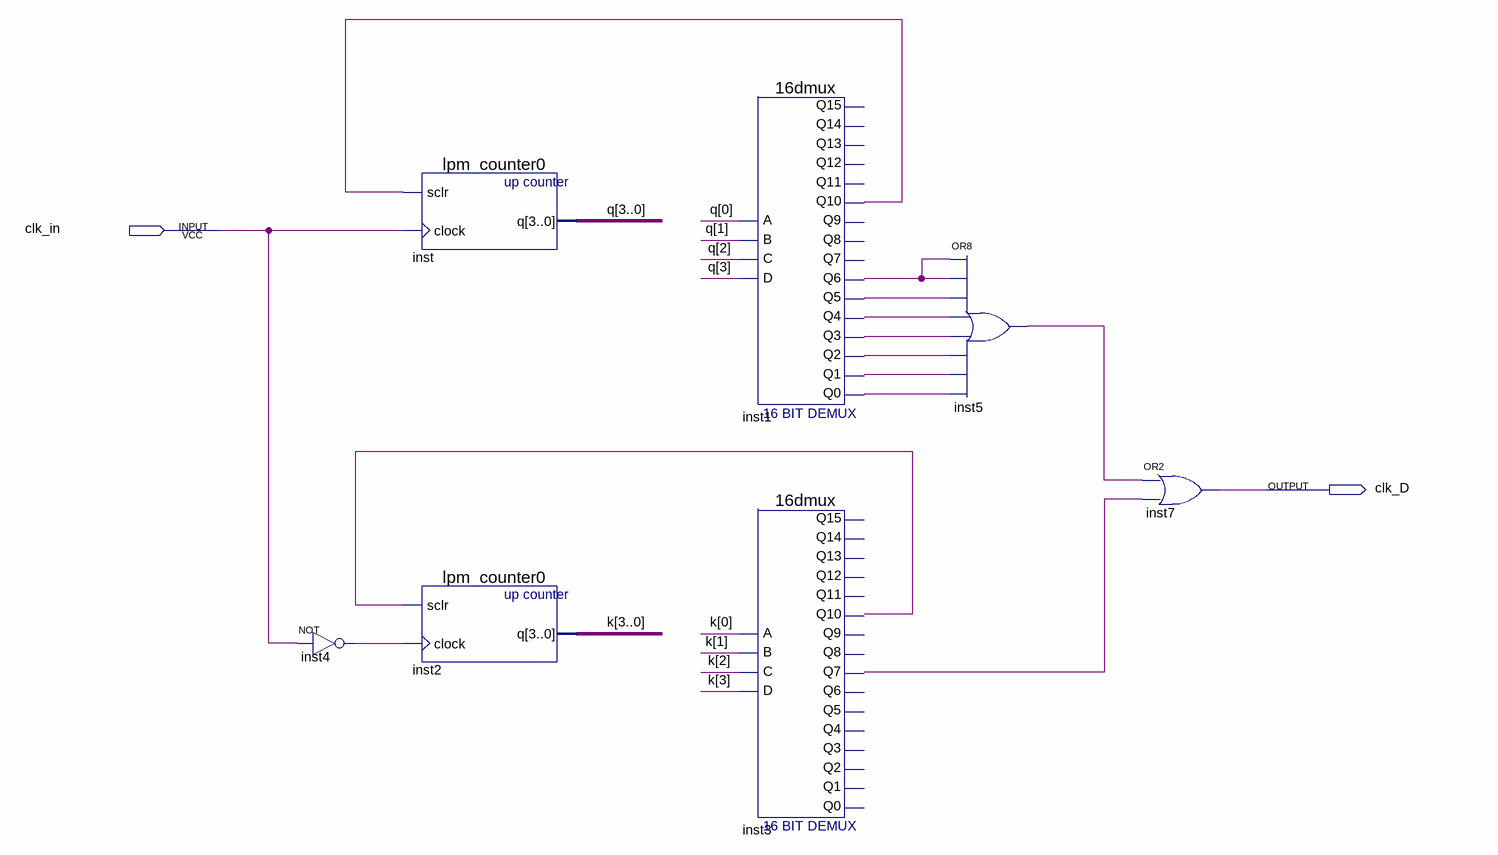
[diagram p0: schematic sheet]
// Quartus schematic lab2_block2.bdf as structural Verilog: 7 symbols, 2 pins
module lab2_block2 (
  input  clk_in,
  output clk_D
);

  wire inst1_q0, inst1_q1, inst1_q2, inst1_q3, inst1_q4, inst1_q5, inst1_q6, inst1_q10, inst3_q7, inst3_q10,
       inst4_out, inst5_out;
  wire [3:0] k, q;

  not inst4 (inst4_out, clk_in);
  lpm_counter0 inst (.sclr(inst1_q10), .clock(clk_in), .q(q));
  lpm_counter0 inst2 (.sclr(inst3_q10), .clock(inst4_out), .q(k));
  \16dmux  inst1 (
    .C(q[2]), .B(q[1]), .A(q[0]), .D(q[3]), .Q10(inst1_q10), .Q4(inst1_q4), .Q5(inst1_q5), .Q6(inst1_q6),
    .Q2(inst1_q2), .Q3(inst1_q3), .Q0(inst1_q0), .Q1(inst1_q1));  // open: Q12, Q13, Q11, Q9, Q7, Q8, Q14, Q15
  \16dmux  inst3 (
    .C(k[2]), .B(k[1]), .A(k[0]), .D(k[3]), .Q10(inst3_q10), .Q7(inst3_q7));  // open: Q12, Q13, Q11, Q9, Q8, Q4, Q5, Q6, Q2, Q3, Q14, Q15, Q0, Q1
  or inst5 (inst5_out, inst1_q6, inst1_q6, inst1_q5, inst1_q4, inst1_q3, inst1_q2, inst1_q1, inst1_q0);
  or inst7 (clk_D, inst5_out, inst3_q7);
endmodule
